# Altium project PDB_REV 22.PrjPcb
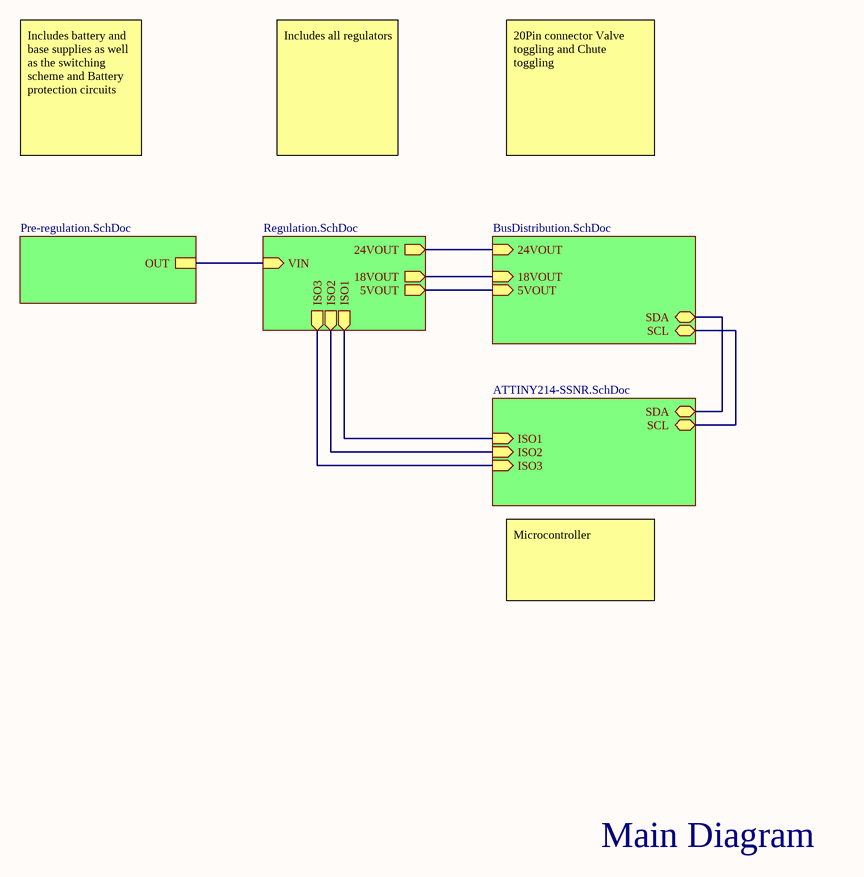
[diagram p0: Main.SchDoc]
10 sheets, 151 parts. Net scope: hierarchical (ports join the sheet entries above them; power ports are global).
Board file: PDB REV 22.PcbDoc
Sheets:
  Main.SchDoc
    U_Intrumentation = ATTINY214-SSNR.SchDoc
    U_Supply&Switching = Pre-regulation.SchDoc
      U_BattVoltageLevelDetector = BattVoltageLevelDetector.SchDoc
      U_Switching_Scheme = Switching_Scheme.SchDoc
    U_Regulation = Regulation.SchDoc
      U_CurrentSensor = CurrentSensor.SchDoc
      U_CurrentSensor = CurrentSensor.SchDoc
      U_CurrentSensor = CurrentSensor.SchDoc
      U_SwitchingRegulator = SwitchingRegulator.SchDoc
    U_BusDistribution = BusDistribution.SchDoc
      VTogg1 = ValveToggling.SchDoc
      VTogg2 = ValveToggling.SchDoc
      VTogg3 = ValveToggling.SchDoc
      VTogg4 = ValveToggling.SchDoc
      VTogg5 = ValveToggling.SchDoc
      VTogg6 = ValveToggling.SchDoc
      VTogg7 = ValveToggling.SchDoc
      VTogg8 = ValveToggling.SchDoc

## Sheet Main.SchDoc
size A

### Sub-sheets
U_BusDistribution = BusDistribution.SchDoc: 24VOUT (in), 5VOUT (in), 18VOUT (in), SDA (bidir), SCL (bidir)
U_Intrumentation = ATTINY214-SSNR.SchDoc: SDA (bidir), SCL (bidir), ISO1 (in), ISO2 (in), ISO3 (in)
U_Regulation = Regulation.SchDoc: ISO1 (out), ISO2 (out), ISO3 (out), 24VOUT (out), VIN (in), 18VOUT (out), 5VOUT (out)
U_Supply&Switching = Pre-regulation.SchDoc: OUT

### Nets
5VOUT: sheet U_Regulation/5VOUT, sheet U_BusDistribution/5VOUT
18VOUT: sheet U_Regulation/18VOUT, sheet U_BusDistribution/18VOUT
24VOUT: sheet U_Regulation/24VOUT, sheet U_BusDistribution/24VOUT
FET_A: sheet U_Supply&Switching/OUT, sheet U_Regulation/VIN
NetIC1_1_1: sheet U_Intrumentation/ISO3, sheet U_Regulation/ISO3
NetIC1_2_1: sheet U_Intrumentation/ISO2, sheet U_Regulation/ISO2
NetIC1_3_1: sheet U_Intrumentation/ISO1, sheet U_Regulation/ISO1
NetP1_19: sheet U_Intrumentation/SCL, sheet U_BusDistribution/SCL
NetP1_20: sheet U_Intrumentation/SDA, sheet U_BusDistribution/SDA

### Notes on the sheet
- Includes battery and base supplies as well as the switching scheme and Battery protection circuits
- Includes all regulators
- 20Pin connector Valve toggling and Chute toggling
- Microcontroller
- Main Diagram

## Sheet ATTINY214-SSNR.SchDoc
size A
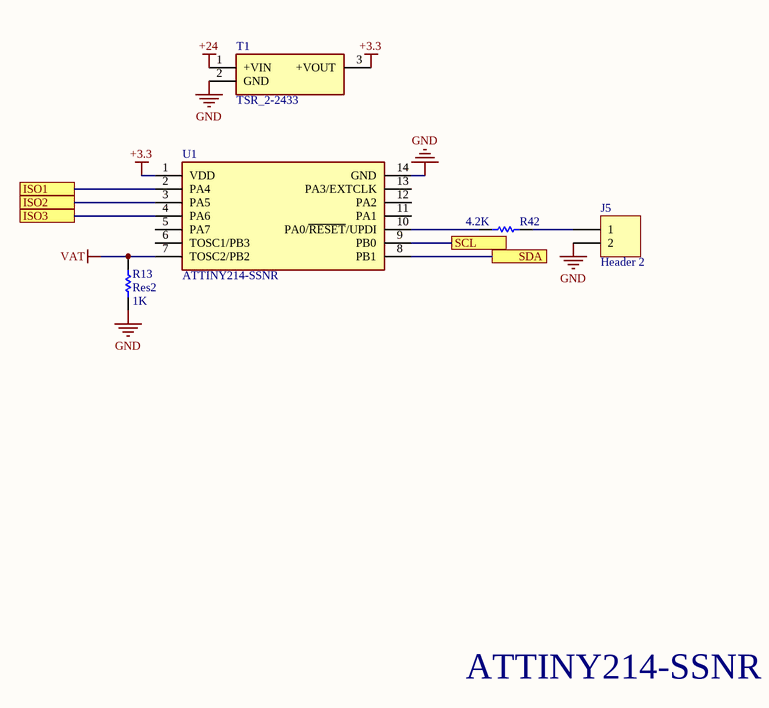
[diagram p1: ATTINY214-SSNR.SchDoc]

### Parts
J5  Header 2  [HDR1X2]
R13  Res2  value 1K  [0402]
R42  value 4.2K  [0402]  (hidden comment: Res10)
T1  TSR_2-2433  [TSR_2-2433]
U1  ATTINY214-SSNR  [SOIC127P600X175-14N]

### Ports
ISO1, ISO2, ISO3, SCL, SDA

### Nets
+3.3: T1.3(+VOUT) U1.1(VDD)
+24: T1.1(+VIN)  [project net IN+]
GND: J5.2 R13.1 T1.2(GND) U1.14(GND)
VAT: R13.2 U1.7(TOSC2/PB2)
NetIC1_1_1: U1.4(PA6) ; port ISO3
NetIC1_2_1: U1.3(PA5) ; port ISO2
NetIC1_3_1: U1.2(PA4) ; port ISO1
NetJ5_1: J5.1 R42.2
NetP1_19: U1.9(PB0) ; port SCL
NetP1_20: U1.8(PB1) ; port SDA
NetR42_1: R42.1 U1.10(PA0/~{RESET}/UPDI)

Not connected (* = marked no-connect by the designer): U1 5(PA7) 6(TOSC1/PB3) 11(PA1) 12(PA2) 13(PA3/EXTCLK)

### Notes on the sheet
- ATTINY214-SSNR

### Library data of the parts
J5 = Header 2: Header, 2-Pin; LatestRevisionDate: 17-Jul-2002; LatestRevisionNote: Re-released for DXP Platform.; Publisher: Altium Limited
R13 R42 = Res1: Resistor; Published: 8-Jun-2000; LatestRevisionDate: 17-Jul-2002; LatestRevisionNote: Re-released for DXP Platform.; PackageReference: AXIAL-0.3; Publisher: Altium Limited; PackageDescription: Axial Device, Thru-Hole; 2 Leads; 0.3 in Pin Spacing
T1 = TSR_2-2433: Transformer; Manufacturer_Name: Traco Power; Manufacturer_Part_Number: TSR 2-2433; Allied_Number: 71066182; Datasheet Link: http://assets.tracopower.com/20170228093640/TSR2/documents/tsr2-datasheet.pdf; Mouser Part Number: 495-TSR2-2433; Mouser Price/Stock: https://www.mouser.com/Search/Refine.aspx?Keyword=495-TSR2-2433; RS Part Number: 9068478P; RS Price/Stock: http://uk.rs-online.com/web/p/products/9068478P; Allied Price/Stock: https://www.alliedelec.com/tracopower-tsr-2-2433/71066182/
U1 = ATTINY214-SSNR: Undefined or Miscellaneous; Manufacturer_Name: Microchip; Datasheet Link: http://ww1.microchip.com/downloads/en/DeviceDoc/40001912A.pdf; Height: 1.75mm; Manufacturer_Part_Number: ATTINY214-SSNR; Mouser Part Number: 579-ATTINY214-SSNR; Mouser Price/Stock: https://www.mouser.com/Search/Refine.aspx?Keyword=579-ATTINY214-SSNR

## Sheet Pre-regulation.SchDoc
size A
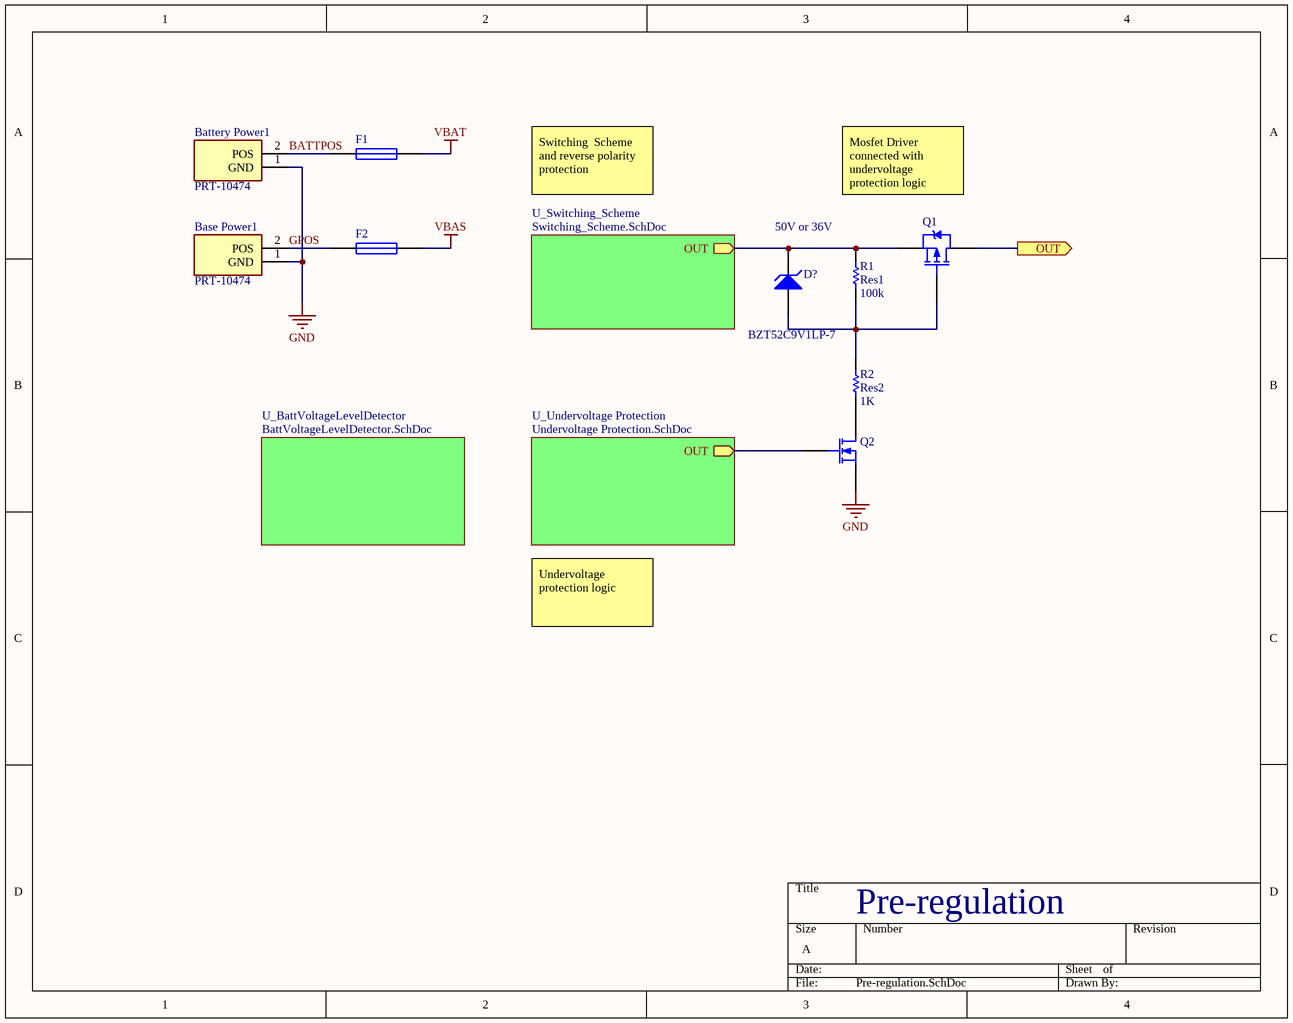
[diagram p2: Pre-regulation.SchDoc]

### Parts
Base_Power1  PRT-10474  [PRT-10474]
Battery_Power1  PRT-10474  [PRT-10474]
D?  BZT52C9V1LP-7  [0402]
F1  Battery Power Fuse  [14-1210]  (value not drawn)
F2  Ground Power Fuse  [14-1210]  (value not drawn)
Q1  Power PMOS  [TO-220AB]  (value not drawn)
Q2  Low power NMOS  [SOT23_L]  (value not drawn)
R1  Res1  value 100k  [0402]
R2  Res2  value 1K  [0402]

### Sub-sheets
U_BattVoltageLevelDetector = BattVoltageLevelDetector.SchDoc: no entries
U_Switching_Scheme = Switching_Scheme.SchDoc: OUT (out)
U_Undervoltage Protection = Undervoltage Protection.SchDoc (file not in this document): OUT (out)

### Ports
OUT (out)

### Nets
GND: Base_Power1.1(GND) Battery_Power1.1(GND) Q2.3(S)
VBAS: F2.2
VBAT: F1.2
BATTPOS: Battery_Power1.2(POS) F1.1
FET_A: Q1.2(D) ; port OUT
GPOS: Base_Power1.2(POS) F2.1
NetC3_1: D?.2(K) Q1.3(S) R1.2 ; sheet U_Switching_Scheme/OUT
NetD?_1: D?.1(A) Q1.1(G) R1.1 R2.2
NetQ2_1: Q2.1(D) R2.1
NetQ2_2: Q2.2(G) ; sheet U_Undervoltage Protection/OUT

### Notes on the sheet
- Switching  Scheme and reverse polarity protection
- 50V or 36V
- Mosfet Driver connected with undervoltage protection logic
- Undervoltage protection logic
- Pre-regulation

### Library data of the parts
Base_Power1 Battery_Power1 = PRT-10474: Connector; Manufacturer_Name: SparkFun; Datasheet Link: http://cdn.sparkfun.com/datasheets/Prototyping/xt60.pdf; Height: 15.875mm; Manufacturer_Part_Number: PRT-10474; Mouser Part Number: 474-PRT-10474; Mouser Price/Stock: https://www.mouser.com/Search/Refine.aspx?Keyword=474-PRT-10474
D? = D Zener: Zener Diode 9.1V 250mW ±6% Surface Mount X1-DFN1006-2; MFG: Diodes Incorporated; Package: 0402; MFG PN: BZT52C9V1LP-7
F1 F2 = Fuse 1: Fuse; Published: 8-Jun-2000; LatestRevisionDate: 17-Jul-2002; LatestRevisionNote: Re-released for DXP Platform.; PackageReference: PIN-W2/E2.8; Publisher: Altium Limited; PackageDescription: Thru-Hole; 2 Leads
Q1 = PMOS-2: P-Channel Power MOSFET; Note: Pin 4 not drawn and electrically connected to Pin 2.; Published: 8-Jun-2000; LatestRevisionDate: 17-Jul-2002; LatestRevisionNote: Re-released for DXP Platform.; DatasheetVersion: PD-9.390D; PackageVersion: Feb-1997; PackageReference: TO-220AB; Publisher: Altium Limited; PackageDescription: TO, Thru-Hole, Vertical, Heatsink Mounted; 3 In-Line Leads; Pitch 2.54 mm; ComponentLink1Description: Manufacturer Link; ComponentLink1URL: http://www.irf.com/
Q2 = MOSFET-N: N-Channel MOSFET; Published: 8-Jun-2000; LatestRevisionDate: 17-Jul-2002; LatestRevisionNote: Re-released for DXP Platform.; PackageVersion: 1995/1996; PackageReference: E3; Publisher: Altium Limited; PackageDescription: TO, Flat Index; 3 In-Line, Axial Leads; Body Dia. 4.6mm; Lead Dia. 0.5 mm (max)
R1 R2 = Res1: Resistor; Published: 8-Jun-2000; LatestRevisionDate: 17-Jul-2002; LatestRevisionNote: Re-released for DXP Platform.; PackageReference: AXIAL-0.3; Publisher: Altium Limited; PackageDescription: Axial Device, Thru-Hole; 2 Leads; 0.3 in Pin Spacing

## Sheet BattVoltageLevelDetector.SchDoc
size A
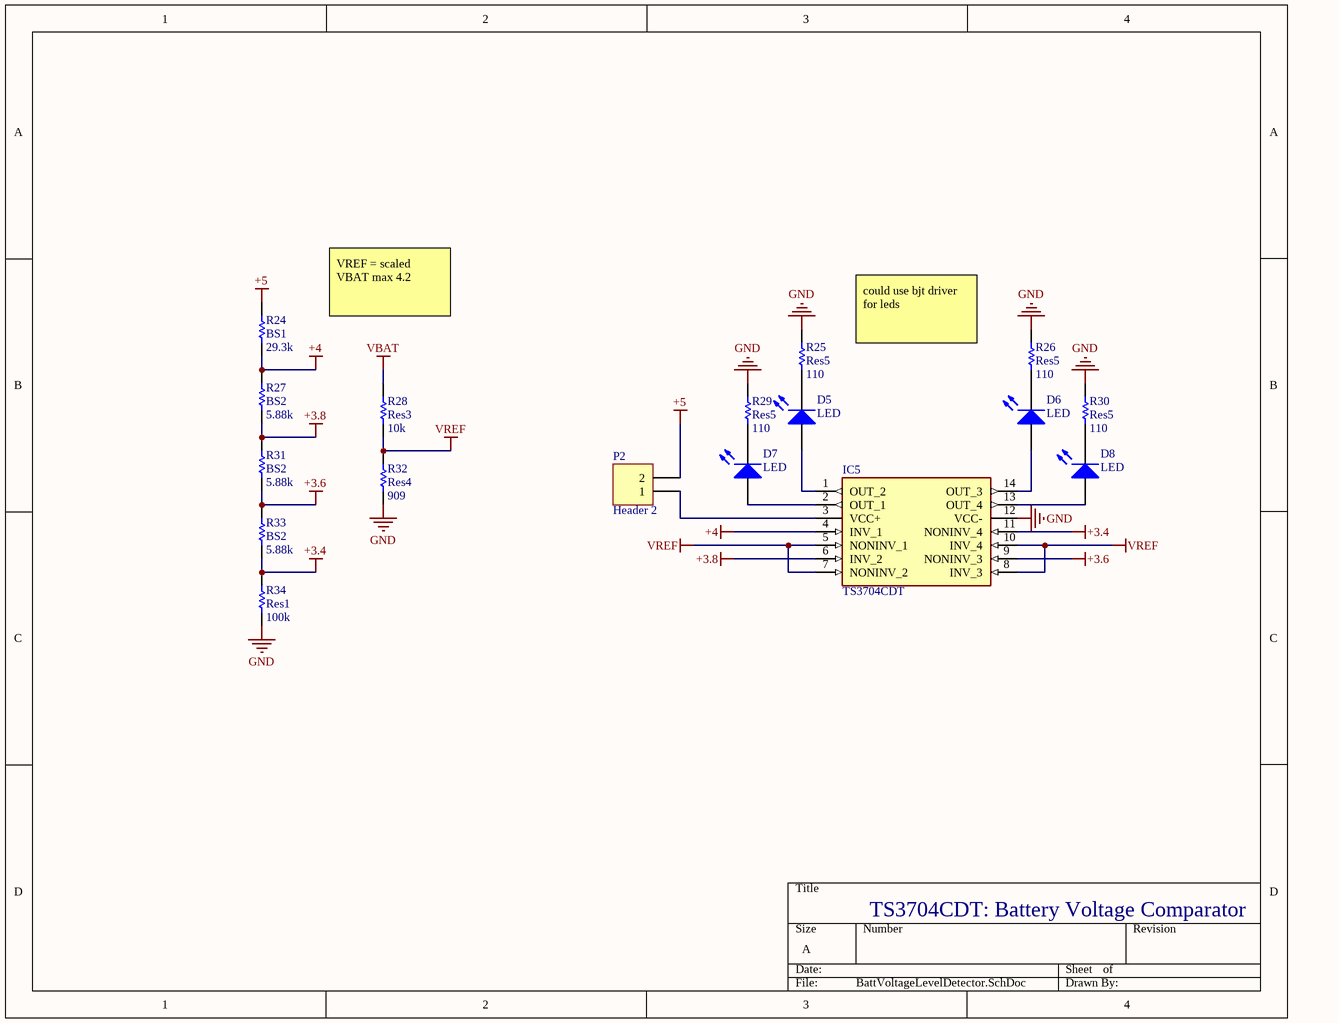
[diagram p3: BattVoltageLevelDetector.SchDoc]

### Parts
D5  LED  [0402]
D6  LED  [0402]
D7  LED  [0402]
D8  LED  [0402]
IC5  TS3704CDT  [SOIC127P600X175-14N]
P2  Header 2  [HDR1X2]
R24  BS1  value 29.3k  [0402]
R25  Res5  value 110  [0402]
R26  Res5  value 110  [0402]
R27  BS2  value 5.88k  [0402]
R28  Res3  value 10k  [0402]
R29  Res5  value 110  [0402]
R30  Res5  value 110  [0402]
R31  BS2  value 5.88k  [0402]
R32  Res4  value 909  [0402]
R33  BS2  value 5.88k  [0402]
R34  Res1  value 100k  [0402]

### Nets
+3.4: IC5.11(NONINV_4) R33.1 R34.2
+3.6: IC5.9(NONINV_3) R31.1 R33.2
+3.8: IC5.6(INV_2) R27.1 R31.2
+4: IC5.4(INV_1) R24.1 R27.2
+5: P2.2 R24.2  [project net 5VOUT]
GND: IC5.12(VCC-) R25.2 R26.2 R29.2 R30.2 R32.1 R34.1
VBAT: R28.2
VREF: IC5.5(NONINV_1) IC5.7(NONINV_2) IC5.8(INV_3) IC5.10(INV_4) R28.1 R32.2
NetD5_1: D5.1(A) IC5.1(OUT_2)
NetD5_2: D5.2(K) R25.1
NetD6_1: D6.1(A) IC5.14(OUT_3)
NetD6_2: D6.2(K) R26.1
NetD7_1: D7.1(A) IC5.2(OUT_1)
NetD7_2: D7.2(K) R29.1
NetD8_1: D8.1(A) IC5.13(OUT_4)
NetD8_2: D8.2(K) R30.1
NetIC5_3: IC5.3(VCC+) P2.1

### Notes on the sheet
- VREF = scaled VBAT max 4.2
- could use bjt driver for leds
- TS3704CDT: Battery Voltage Comparator

### Library data of the parts
D5-D8 = LED0: Typical INFRARED GaAs LED; Published: 8-Jun-2000; LatestRevisionDate: 08-Jul-2005; LatestRevisionNote: Mech Layer 1 removed.; PackageReference: LED-0; Publisher: Altium Limited; PackageDescription: LED; 2 Leads
IC5 = TS3704CDT: Integrated Circuit; Manufacturer_Name: STMicroelectronics; Datasheet Link: http://www.st.com/content/ccc/resource/technical/document/datasheet/ff/2a/23/35/c2/34/44/f1/CD00000883.pdf/files/CD00000883.pdf/jcr:content/translations/en.CD00000883.pdf; Height: 1.75mm; Manufacturer_Part_Number: TS3704CDT; Mouser Part Number: 511-TS3704CDT; Mouser Price/Stock: https://www.mouser.com/Search/Refine.aspx?Keyword=511-TS3704CDT; RS Part Number: 8805496P; RS Price/Stock: http://uk.rs-online.com/web/p/products/8805496P
P2 = Header 2: Header, 2-Pin; LatestRevisionDate: 17-Jul-2002; LatestRevisionNote: Re-released for DXP Platform.; Publisher: Altium Limited
R24-R34 = Res1: Resistor; Published: 8-Jun-2000; LatestRevisionDate: 17-Jul-2002; LatestRevisionNote: Re-released for DXP Platform.; PackageReference: AXIAL-0.3; Publisher: Altium Limited; PackageDescription: Axial Device, Thru-Hole; 2 Leads; 0.3 in Pin Spacing

## Sheet Switching_Scheme.SchDoc
size A
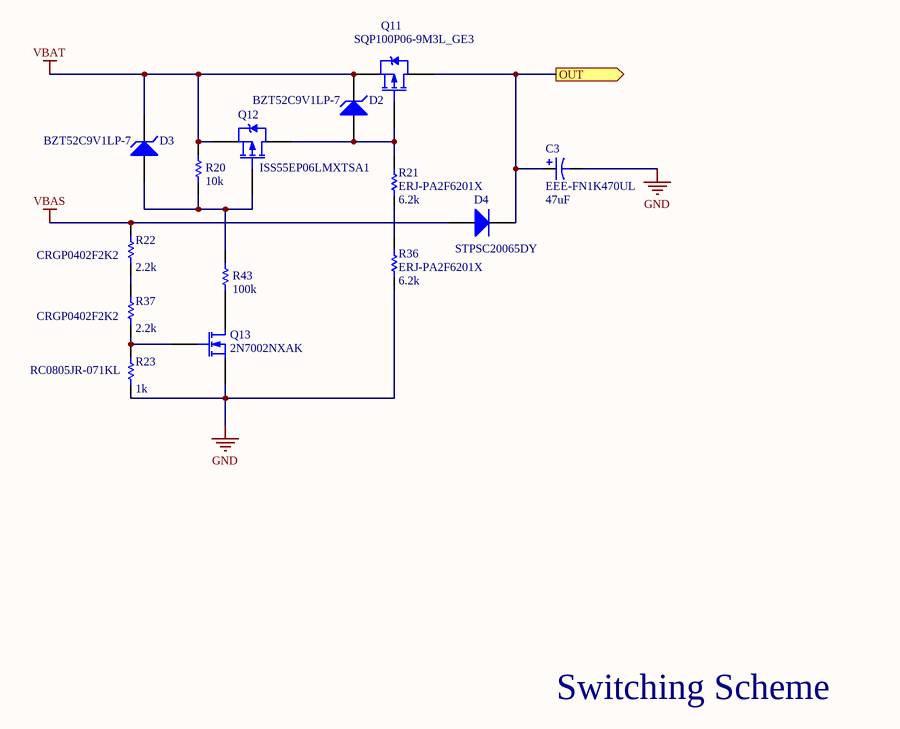
[diagram p4: Switching_Scheme.SchDoc]

### Parts
C3  EEE-FN1K470UL  value 47uF  [CAPAE1030X1450N]
D2  BZT52C9V1LP-7  [0402]
D3  BZT52C9V1LP-7  [0402]
D4  STPSC20065DY  [TO-220AC]
Q11  SQP100P06-9M3L_GE3  [TO-220AB]
Q12  ISS55EP06LMXTSA1  [SOT23_L]
Q13  2N7002NXAK  [SOT23_L]
R20  value 10k  [0402]  (hidden comment: RC0402FR-0710KL)
R21  ERJ-PA2F6201X  value 6.2k  [0402]
R22  CRGP0402F2K2  value 2.2k  [0402]
R23  RC0805JR-071KL  value 1k  [0402]
R36  ERJ-PA2F6201X  value 6.2k  [0402]
R37  CRGP0402F2K2  value 2.2k  [0402]
R43  value 100k  [0402]  (hidden comment: RC0402FR-0710KL)

### Ports
OUT (out)

### Nets
GND: C3.2 Q13.3(S) R23.1 R36.2
VBAS: D4.1(A) R22.2
VBAT: D2.2(K) D3.2(K) Q11.3(S) Q12.3(S) R20.2
NetC3_1: C3.1 D4.2(K) Q11.2(D) ; port OUT
NetD2_1: D2.1(A) Q11.1(G) Q12.2(D) R21.1
NetD3_1: D3.1(A) Q12.1(G) R20.1 R43.2
NetQ13_1: Q13.1(D) R43.1
NetQ13_2: Q13.2(G) R23.2 R37.1
NetR21_2: R21.2 R36.1
NetR22_1: R22.1 R37.2

### Notes on the sheet
- Switching Scheme

### Library data of the parts
C3 = Cap Pol1: 80VDC 47uF 20% 8x10.2mm AEC-Q200; MFG PN: EEH-ZF1J330P; MFG: Panasonic
D2 D3 = D Zener: as D? on sheet Pre-regulation; Package: 0402; MFG PN: BZT52C9V1LP-7
D4 = Diode: Diode Silicon Carbide Schottky 650V 20A Through Hole TO-220AC; pin to pad: 2>3; MFG: STMicroelectronics; MFG PN: STPSC20065DY
Q11 = PMOS-2: P-Channel 60V 100A (Tc) 187W (Tc) Through Hole TO-220AB; Published: 8-Jun-2000; LatestRevisionDate: 17-Jul-2002; LatestRevisionNote: Re-released for DXP Platform.; DatasheetVersion: PD-9.390D; PackageVersion: Feb-1997; PackageReference: TO-220AB; Publisher: Vishay Siliconix; PackageDescription: TO, Thru-Hole, Vertical, Heatsink Mounted; 3 In-Line Leads; Pitch 2.54 mm; ComponentLink1Description: Manufacturer Link; ComponentLink1URL: http://www.irf.com/
Q12 = PMOS-2: P-Channel 60V 180mA (Ta) 400mW (Ta) Surface Mount PG-SOT23-3-5; MFG: Infineon Technologies; PackageReference: TO-220AB; Publisher: ISS55EP06LMXTSA1; ComponentLink1Description: Manufacturer Link; ComponentLink1URL: http://www.irf.com/; MFG PN: ISS55EP06LMXTSA1
Q13 = MOSFET-N: N-Channel 60V 190mA (Ta), 300mA (Tc) 265mW (Ta), 1.33W (Tc) Surface Mount TO-236AB; MFG: Nexperia USA; MDF PN: 2N7002NXAK
R20 R43 = Res1: 10 kOhms ±1% 0.063W, 1/16W Chip Resistor 0402 (1005 Metric) Thick Film; Manufacturer: Yageo; MFG PN: RC0402FR-0710KL
R21 R36 = Res1: ±1% 0.2W, 1/5W Chip Resistor 0402 (1005 Metric) Automotive AEC-Q200, Pulse Withstanding Thick Film; Manufacturer: Panasonic Electronic Components; PackageDescription: ±1% 0.2W, 1/5W Chip Resistor 0402 (1005 Metric) Automotive AEC-Q200, Pulse Withstanding Thick Film; MFG PN: ERJ-PA2F6201X
R22 R37 = Res1: 2.2 kOhms ±1% 0.125W, 1/8W Chip Resistor 0402 (1005 Metric) Pulse Withstanding Thick Film; MFG: TE Connectivity Passive Product; MFG PN: CRGP0402F2K2
R23 = Res1: 1 kOhms ±5% 0.125W, 1/8W Chip Resistor 0805 (2012 Metric)  Thick Film; MFG: Yageo; MFG PN: RC0805JR-071KL

## Sheet Regulation.SchDoc
size A
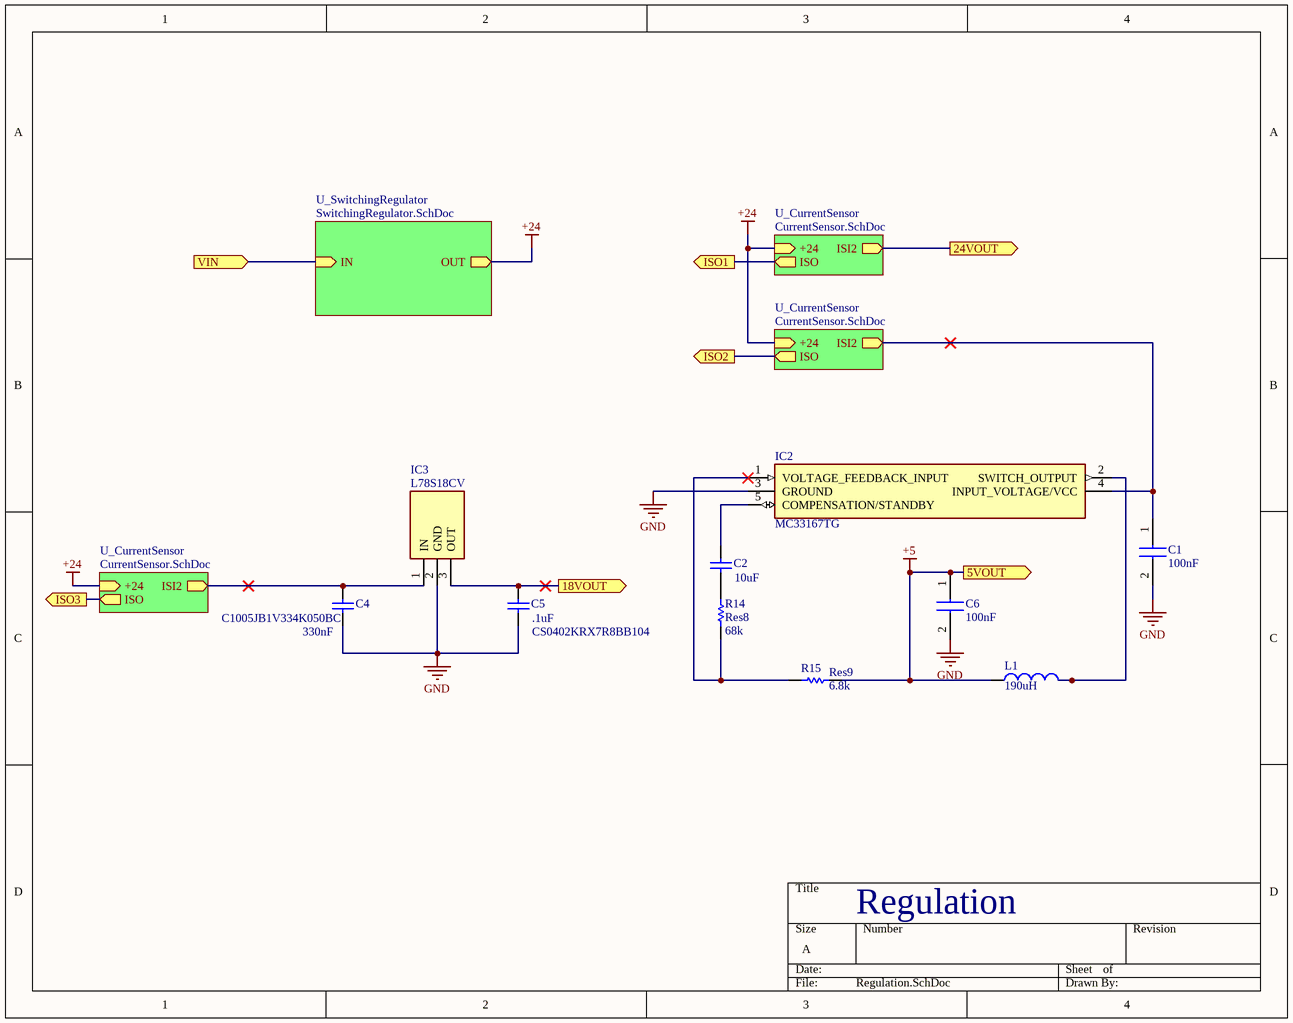
[diagram p5: Regulation.SchDoc]

### Parts
C1  100nF  [865230640001]
C2  value 10uF  [C0805]  (hidden comment: 10uF Cap)
C4  C1005JB1V334K050BC  value 330nF  [0402]
C5  CS0402KRX7R8BB104  value .1uF  [Model Name]
C6  100nF  [865230640001]
IC2  MC33167TG  [MC33167TG]
IC3  L78S18CV  [TO270P460X1020X2008-3P]
L1  value 190uH  [PA2982]  (hidden comment: 190uH Inductor)
R14  Res8  value 68k  [0402]
R15  Res9  value 6.8k  [0402]

### Sub-sheets
U_CurrentSensor = CurrentSensor.SchDoc: ISI2 (out), +24 (in), ISO (out)
U_CurrentSensor = CurrentSensor.SchDoc: ISO (out), +24 (in), ISI2 (out)
U_CurrentSensor = CurrentSensor.SchDoc: +24 (in), ISI2 (out), ISO (out)
U_SwitchingRegulator = SwitchingRegulator.SchDoc: IN (in), OUT (out)

### Ports
5VOUT (out), 18VOUT (out), 24VOUT (out), ISO1 (out), ISO2 (out), ISO3 (out), VIN (in)

### Nets
+5: C6.1(-) L1.1 R15.2 ; port 5VOUT  [project net 5VOUT]
+24: sheet U_CurrentSensor/+24, sheet U_CurrentSensor/+24, sheet U_CurrentSensor/+24, sheet U_SwitchingRegulator/OUT  [project net IN+]
GND: C1.2(+) C4.1 C5.1 C6.2(+) IC2.3(GROUND) IC3.2(GND)
18VOUT: C5.2 IC3.3(OUT) ; port 18VOUT
24VOUT: port 24VOUT, sheet U_CurrentSensor/ISI2
FET_A: port VIN, sheet U_SwitchingRegulator/IN
IN-: C1.1(-) IC2.4(INPUT_VOLTAGE/VCC) ; sheet U_CurrentSensor/ISI2
IN-: C4.2 IC3.1(IN) ; sheet U_CurrentSensor/ISI2  [a separate net that carries the same name]
NetC2_1: C2.1 R14.2
NetC2_2: C2.2 IC2.5(COMPENSATION/STANDBY)
NetIC1_1_1: port ISO3, sheet U_CurrentSensor/ISO
NetIC1_2_1: port ISO2, sheet U_CurrentSensor/ISO
NetIC1_3_1: port ISO1, sheet U_CurrentSensor/ISO
NetIC2_1: IC2.1(VOLTAGE_FEEDBACK_INPUT) R14.1 R15.1
NetIC2_2: IC2.2(SWITCH_OUTPUT) L1.2

### Notes on the sheet
- Regulation

### Library data of the parts
C1 C6 = 865230640001: Capacitor; Manufacturer_Name: Wurth Elektronik; Datasheet Link: http://uk.rs-online.com/webdocs/135a/0900766b8135a640.pdf; Manufacturer_Part_Number: 865230640001; Arrow Part Number: 865230640001; Mouser Part Number: 710-865230640001; Mouser Price/Stock: https://www.mouser.co.uk/ProductDetail/Wurth-Elektronik/865230640001?qs=0KOYDY2FL28kfhWstjZGVg%3D%3D
C2 = Cap: Capacitor; Published: 8-Jun-2000; LatestRevisionDate: 17-Jul-2002; LatestRevisionNote: Re-released for DXP Platform.; PackageReference: RAD-0.3; Publisher: Altium Limited; PackageDescription: Radial Cap, Thru-Hole; 2 Leads; 0.3 in Pin Spacing
C4 = Cap: CAP CER 0.33UF 35V JB 0402; Manufacturer 1: TDK Corporation; Published: 8-Jun-2000; LatestRevisionDate: 17-Jul-2002; LatestRevisionNote: Re-released for DXP Platform.; PackageReference: RAD-0.3; Publisher: Altium Limited; PackageDescription: Radial Cap, Thru-Hole; 2 Leads; 0.3 in Pin Spacing; Manufacturer Part Number 1: C1005JB1V334K050BC
C5 = Cap: CAP CER 0.1UF 25V X7R 0402; Manufacturer 1: Yageo; LatestRevisionNote: Re-released for DXP Platform.; PackageReference: RAD-0.3; Publisher: Altium Limited; PackageDescription: Radial Cap, Thru-Hole; 2 Leads; 0.3 in Pin Spacing; Manufacturer Part Number 1: CS0402KRX7R8BB104
IC2 = MC33167TG: Integrated Circuit; Manufacturer_Name: ON Semiconductor; Allied_Number: 70340012; Datasheet Link: http://www.onsemi.com/pub/Collateral/MC34167-D.PDF; Manufacturer_Part_Number: MC33167TG; Mouser Part Number: 863-MC33167TG; Mouser Price/Stock: https://www.mouser.com/Search/Refine.aspx?Keyword=863-MC33167TG; RS Part Number: 7862414P; RS Price/Stock: http://uk.rs-online.com/web/p/products/7862414P; Allied Price/Stock: http://www.alliedelec.com/on-semiconductor-mc33167tg/70340012/
IC3 = L78S18CV: Integrated Circuit; Manufacturer_Name: STMicroelectronics; Allied_Number: 70013917; Datasheet Link: http://www.st.com/web/en/resource/technical/document/datasheet/CD00000449.pdf; Height: 4.6mm; Manufacturer_Part_Number: L78S18CV; Mouser Part Number: 511-L78S18CV; Mouser Price/Stock: https://www.mouser.com/Search/Refine.aspx?Keyword=511-L78S18CV; RS Part Number: 6869022P; RS Price/Stock: http://uk.rs-online.com/web/p/products/6869022P; Allied Price/Stock: http://www.alliedelec.com/stmicroelectronics-l78s18cv/70013917/
L1 = Inductor: Code_IEC: 1005; Published: 8-Jun-2000; LatestRevisionDate: 29-May-2009; LatestRevisionNote: IPC-7351 Footprint Added.; PackageReference: 0402-A; Publisher: Altium Limited; PackageDescription: Chip Inductor; Code_JEITA: 0402
R14 R15 = Res1: Resistor; Published: 8-Jun-2000; LatestRevisionDate: 17-Jul-2002; LatestRevisionNote: Re-released for DXP Platform.; PackageReference: AXIAL-0.3; Publisher: Altium Limited; PackageDescription: Axial Device, Thru-Hole; 2 Leads; 0.3 in Pin Spacing

## Sheet CurrentSensor.SchDoc
size A
Used 3 times, as channels U_Regulation/U_CurrentSensor, U_Regulation/U_CurrentSensor, U_Regulation/U_CurrentSensor. Parts and nets are listed once, with the designators drawn on the sheet.
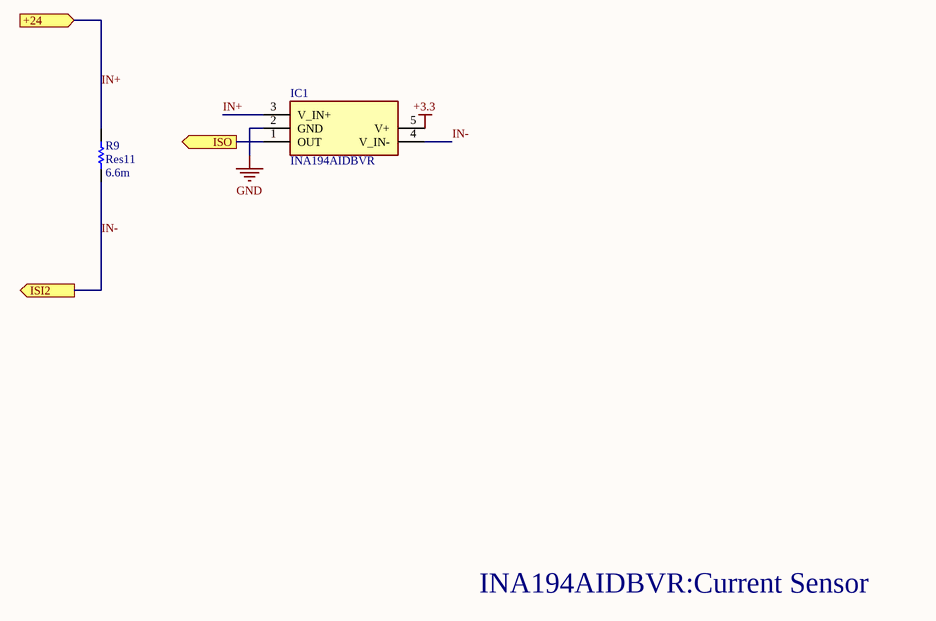
[diagram p6: CurrentSensor.SchDoc]

### Parts
IC1  INA194AIDBVR  [SOT95P280X145-5N]
R9  Res11  value 6.6m  [0402]

### Ports
+24 (in), ISI2 (out), ISO (out)

### Nets
+3.3: IC1.5(V+)
GND: IC1.2(GND)
IN+: IC1.3(V_IN+) R9.2 ; port +24
IN-: IC1.4(V_IN-) R9.1 ; port ISI2
ISO: IC1.1(OUT) ; port ISO

### Channels
U_Regulation/U_CurrentSensor: designators end in _3; ports +24=IN+ ISI2=24VOUT ISO=NetIC1_3_1
U_Regulation/U_CurrentSensor: designators end in _2; ports +24=IN+ ISI2=IN- ISO=NetIC1_2_1
U_Regulation/U_CurrentSensor: designators end in _1; ports +24=IN+ ISI2=IN- ISO=NetIC1_1_1

### Notes on the sheet
- INA194AIDBVR:Current Sensor

### Library data of the parts
IC1 = INA194AIDBVR: Integrated Circuit; Manufacturer_Name: Texas Instruments; Datasheet Link: http://www.ti.com/lit/gpn/ina194; Height: 1.45mm; Manufacturer_Part_Number: INA194AIDBVR; Mouser Part Number: 595-INA194AIDBVR; Mouser Price/Stock: https://www.mouser.com/Search/Refine.aspx?Keyword=595-INA194AIDBVR
R9 = Res1: Resistor; Published: 8-Jun-2000; LatestRevisionDate: 17-Jul-2002; LatestRevisionNote: Re-released for DXP Platform.; PackageReference: AXIAL-0.3; Publisher: Altium Limited; PackageDescription: Axial Device, Thru-Hole; 2 Leads; 0.3 in Pin Spacing

## Sheet SwitchingRegulator.SchDoc
size A
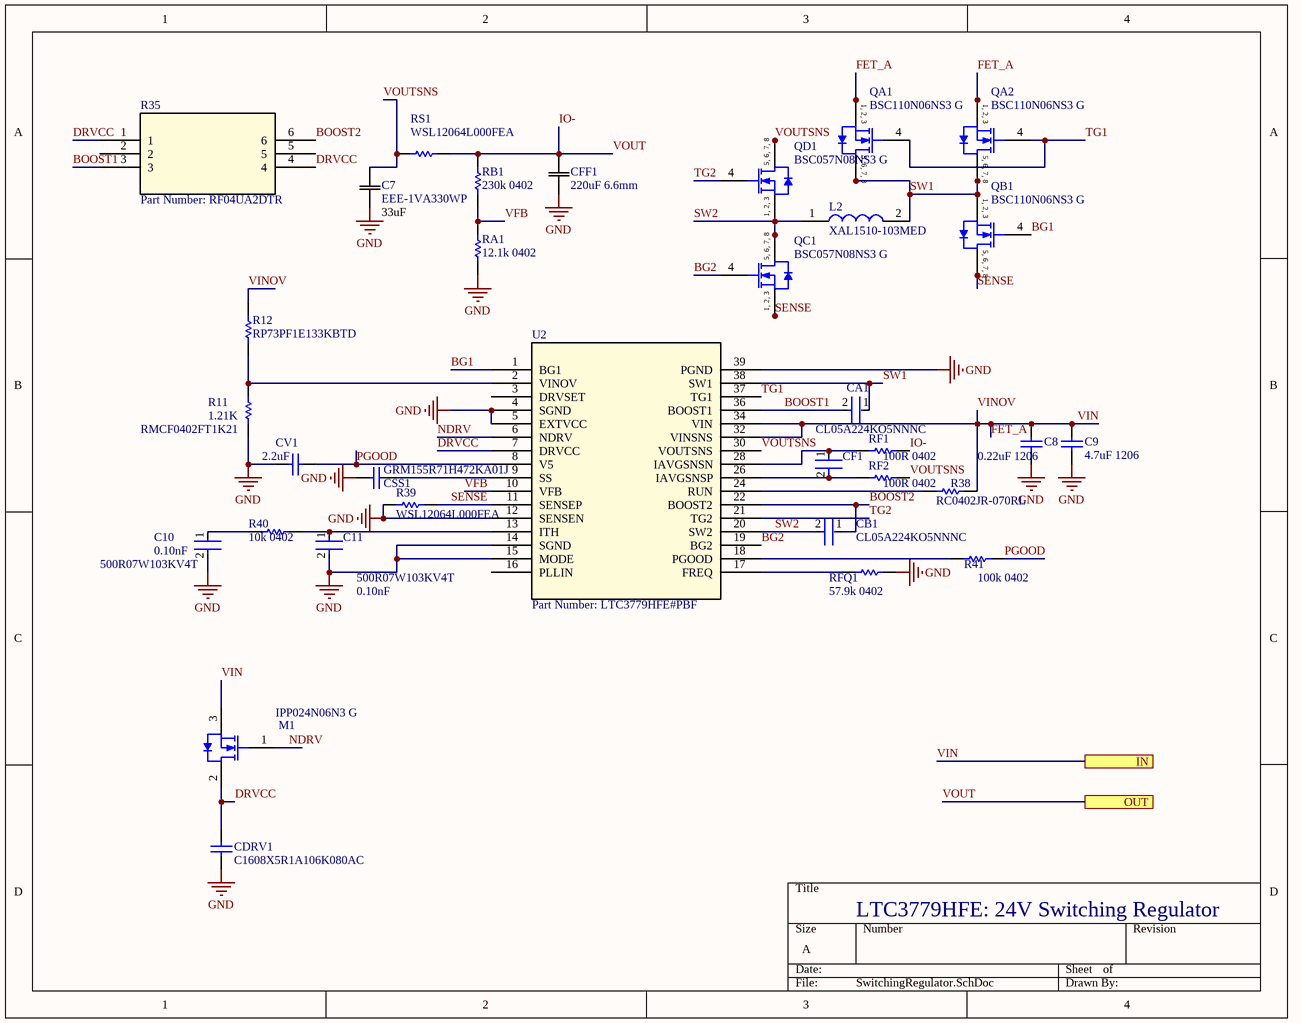
[diagram p7: SwitchingRegulator.SchDoc]

### Parts
C7  EEE-1VA330WP  value 33uF  [CAPAE660X800N]
C8  0.22uF 1206  [CAPC1608X90X35ML10T15]
C9  4.7uF 1206  [CAPC3216X180X50ML20T25]
C10  500R07W103KV4T  Capacitance: 0.10nF  [FP-GRM15-MFG]
C11  500R07W103KV4T  Capacitance: 0.10nF  [FP-GRM15-MFG]
CA1  CL05A224KO5NNNC  [FP-GRM15-MFG]
CB1  CL05A224KO5NNNC  [FP-GRM15-MFG]
CDRV1  C1608X5R1A106K080AC  [CAPC1608X90X20ML10]
CF1  C1608X5R1C335K080AC  [FP-GRM15-MFG]  (value not drawn)
CFF1  220uF 6.6mm  [CAPAE660X800N]
CSS1  GRM155R71H472KA01J  [CAPC1005X55X25NL05T10]
CV1  value 2.2uF  [CAPC1005X55X25ML05T10]  (hidden comment: GRM155R60J225ME15D)
L2  XAL1510-103MED  [XAL1513153MEB]
M1  IPP024N06N3 G  [INF-PG-TO220-3-1_A_V]
QA1  BSC110N06NS3 G  [INF-PG-TDSON-8-1_V]
QA2  BSC110N06NS3 G  [INF-PG-TDSON-8-1_V]
QB1  BSC110N06NS3 G  [INF-PG-TDSON-8-1_V]
QC1  BSC057N08NS3 G  [INF-PG-TDSON-8-1_V]
QD1  BSC057N08NS3 G  [INF-PG-TDSON-8-1_V]
R11  RMCF0402FT1K21  value 1.21K  [RESC1005X40X25NL05T10]
R12  RP73PF1E133KBTD  [RESC1005X40X25NL05T10]
R35  Part Number: RF04UA2DTR  [RF04]
R38  RC0402JR-070RL  [RESC1005X40X25NL05T10]
R39  WSL12064L000FEA  [RESC3216X89X51LL25T25]
R40  10k 0402  [RESC1005X40X25NL05T10]
R41  100k 0402  [RESC1005X40X25NL05T10]
RA1  12.1k 0402  [RESC1005X40X25NL05T10]
RB1  230k 0402  [RESC1005X40X25NL05T10]
RF1  100R 0402  [RESC1005X40X25NL05T05]
RF2  100R 0402  [RESC1005X40X25NL05T05]
RFQ1  57.9k 0402  [RESC1005X40X25NL05T10]
RS1  WSL12064L000FEA  [RESC3216X89X51LL25T25]
U2  Part Number: LTC3779HFE#PBF  [SOP50P640X120-39N]

### Ports
IN, OUT

### Nets
GND: C7.1 C8.1 C9.1 C10.2 C11.2 CDRV1.1 CFF1.1 CSS1.1 CV1.1 R11.2 R39.1 RA1.1 RFQ1.1 U2.4(SGND) U2.5(EXTVCC) U2.12(SENSEN) U2.14(SGND) U2.15(MODE) U2.39(PGND)
IO-: CFF1.2 RB1.2 RF1.2 RS1.2 ; port OUT  [also labelled VOUT]  [project net IN+]
BG1: QB1.4(GATE) U2.1(BG1)
BG2: QC1.4(GATE) U2.19(BG2)
BOOST1: CA1.2 R35.3 U2.36(BOOST1)
BOOST2: CB1.1 R35.6 U2.22(BOOST2)
DRVCC: CDRV1.2 M1.2(DRAIN) R35.1 R35.4 U2.7(DRVCC)
FET_A: C8.2 C9.2 M1.3(SOURCE) QA1.1(SOURCE) QA1.2(SOURCE) QA1.3(SOURCE) QA2.1(SOURCE) QA2.2(SOURCE) QA2.3(SOURCE) R12.1 R38.1 U2.32(VINSNS) U2.34(VIN) ; port IN  [also labelled VIN, VINOV]
NDRV: M1.1(GATE) U2.6(NDRV)
PGOOD: CV1.2 R41.1 U2.8(V5)
SENSE: QB1.5(DRAIN) QB1.6(DRAIN) QB1.7(DRAIN) QB1.8(DRAIN) QC1.1(SOURCE) QC1.2(SOURCE) QC1.3(SOURCE) R39.2 U2.11(SENSEP)
SW1: CA1.1 L2.2 QA1.5(DRAIN) QA1.6(DRAIN) QA1.7(DRAIN) QA1.8(DRAIN) QA2.5(DRAIN) QA2.6(DRAIN) QA2.7(DRAIN) QA2.8(DRAIN) QB1.1(SOURCE) QB1.2(SOURCE) QB1.3(SOURCE) U2.38(SW1)
SW2: CB1.2 L2.1 QC1.5(DRAIN) QC1.6(DRAIN) QC1.7(DRAIN) QC1.8(DRAIN) QD1.1(SOURCE) QD1.2(SOURCE) QD1.3(SOURCE) U2.20(SW2)
TG1: QA1.4(GATE) QA2.4(GATE) U2.37(TG1)
TG2: QD1.4(GATE) U2.21(TG2)
VFB: RA1.2 RB1.1 U2.10(VFB)
VOUTSNS: C7.2 QD1.5(DRAIN) QD1.6(DRAIN) QD1.7(DRAIN) QD1.8(DRAIN) RF2.2 RS1.1 U2.30(VOUTSNS)
NetC10_1: C10.1 R40.2
NetC11_1: C11.1 R40.1 U2.13(ITH)
NetCF1_1: CF1.1 RF1.1 U2.28(IAVGSNSN)
NetCF1_2: CF1.2 RF2.1 U2.26(IAVGSNSP)
NetCSS1_2: CSS1.2 U2.9(SS)
NetR11_1: R11.1 R12.2 U2.2(VINOV)
NetR38_2: R38.2 U2.24(RUN)
NetR41_2: R41.2 U2.18(PGOOD)
NetRFQ1_2: RFQ1.2 U2.17(FREQ)

Not connected (* = marked no-connect by the designer): R35 2 5; U2 3(DRVSET) 16(PLLIN)

### Notes on the sheet
- LTC3779HFE: 24V Switching Regulator
- (in symbol CMP-1091-00029-1) 5, 6, 7, 8; 1, 2, 3
- (in symbol CMP-1091-00074-1) 1, 2, 3; 5, 6, 7, 8

### Library data of the parts
C7 = UCV1V221MCL1GS: CAP ALUM 33UF 20% 35V SMD; Manufacturer 1: Panasonic Electronic Components; Manufacturer Part Number 1: EEE-1VA330WP
C8 = CMP-2100-03642-1: Chip Capacitor, 10 nF, +/- 10%, 50 V, -55 to 125 degC, 0603 (1608 Metric), RoHS, Tape and Reel; Manufacturer: Murata; Insulation Resistance: 10GR; Dielectric: X7R; Voltage Rating: 50V; Capacitance: 10nF; Material: Ceramic; Package Quantity: 1; Lead Free: LeadFree; Case/Package: 0603; Termination: SMD/SMT; REACH SVHC: Unknown; Manufacturer URL: http://www.murata.com/; Datasheet URL: http://search.murata.co.jp/Ceramy/image/img/A01X/G101/ENG/GRM188R71H103KA01-01.pdf; Mount: SurfaceMount; Datasheet Version: 42401.0; Number of Pins: 2; Length: 1.6mm; Voltage: 50V; Depth: 0.8mm; Tolerance: 10%; Min Operating Temperature: -55degC; Voltage Rating (DC): 50V; Max Operating Temperature: 125degC; Package Description: 2-Pin Surface Mount Device, Body 1.6 x 0.8 mm; RoHSCompliant: True; Case Code (Imperial): 0603; Width: 0.031inch; Case Code (Metric): 1608; Height: 0.8mm; Package Reference: 0603; Packaging: TapeandReel; Thickness: 0.035inch; Dielectric Material: Ceramic
C9 = CMP-2000-04991-1: Chip Capacitor, 1 uF, +/- 10%, 25 V, -55 to 125 degC, 1206 (3216 Metric), RoHS, Tape and Reel; Manufacturer: Kemet; Temperature Coefficient / Code: +/-15%; Capacitance: 1uF; Dielectric: X7R; Voltage Rating DC: 25V; Capacitance - nF: 1000nF; Class: Class1; Case Length: 3.2mm; Type: SMDMLCCX7R6.3-250VDCCommericalGrade; Case Width: 1.6mm; Product: GeneralTypeMLCCs; Datasheet URL: https://ciiva.com/datasheet-click-18194173?src=ciiva&sig=6daff8c4; Operating Temperature Range: -55Cto+125C; Series: C1206C; RoHS: Details; Product Category: MultilayerCeramicCapacitorsMLCC-SMD/SMT; Manufacturer URL: http://www.kemet.com/; Minimum Operating Temperature: -55C; Dimensions: 1.6mmWx3.2mmLx1.6mmH; Termination Style: SMD/SMT; Brand: Kemet; Packaging: Reel; Package / Case: 1206(3216metric); Case Code - mm: 3216; Datasheet Version: Jul-14; Factory Pack Quantity: 2000; Package Description: 2-Pin Surface Mount Device, Body 3.2 x 1.6 mm; Tolerance: 10%; Package Reference: 1206; Case Height: 1.6mm; Case Code - in: 1206; Maximum Operating Temperature: +125C; Voltage Rating: 25V
C10 C11 = CMP-06035-000102-1: CAP CER 0.1UF 16V X7R 0402; Manufacturer Part Number: GRM155R71C104KA88D; Manufacturer: Murata; Manufacturer 1: Johanson Dielectrics Inc.; Standoff Height: 0mm; Tolerance: 10%; Voltage Rating: 16Vdc; Material: Ceramic; Value: 0.10μF; RoHS: TRUE; Temperature Characteristic: X7R; Octopart: https://octopart.com/grm155r71c104ka88d-murata-196880; Digikey Description: CAP CER 0.1UF 16V X7R 0402; Device Class L3: Ceramic Capacitors; Height: 0.55mm; ComponentLink2Description: Datasheet; Temperature Range Low: -55°C; Ipc Land Pattern Name: CAPC10050X219; ComponentLink2URL: https://search.murata.co.jp/Ceramy/image/img/A01X/G101/ENG/GRM155R71H471KA01-01A.pdf; Device Class L1: Passive Components; Lead Free: yes; Category: Cap; Package: GRM15; Temperature: -55°C to +125°C; Device Class L2: Capacitors; Temperature Range High: +125°C; Mouser Description: 0402 0.1 uF 16V ±10 % Tolerance X7R SMT Multilayer Ceramic Capacitor; Manufacturer Part Number 1: 500R07W103KV4T
CA1 CB1 = CMP-06035-000102-1: CAP CER 0.22UF 16V X5R 0402; Manufacturer 1: Samsung Electro-Mechanics; Value: 0.22μF; Manufacturer Part Number 1: CL05A224KO5NNNC
CDRV1 = CMP-2000-04979-1: Chip Capacitor, 10 uF, +/- 10%, 10 V, -55 to 85 degC, 0603 (1608 Metric), RoHS, Tape and Reel; PCN Part Number: MLCCPartNumberChange30/Nov/2012; Manufacturer: TDK; Temperature Coefficient: X5R; Product Training Modules: CSeriesGeneralApplicationsSEAT,CCV,andTVCLDesignToolsGuidetoReplacinganElectrolyticCapacitorwithanMLCC; Online Catalog: CSeries,GeneralPurpose; Voltage - Rated: 10V; Other Names: 445-7486-1; Capacitance: 10µF; Design Resources: 20WNon-IsolatedBuckLEDDriverUsingPLLNK460KG; Kits: 445-9003-KIT-ND-KITCAPCERHICAPMLCCSMD; Height - Seated (Max): -; Family: CeramicCapacitors; Package Description: 2-Pin Surface Mount Device, Body 1.6 x 0.8 mm; Category: Capacitors; Datasheet Version: Mar-15; RoHS Information: RoHSCertificate-MLCC; Thickness (Max): 0.035"(0.90mm); Operating Temperature: -55degC~85degC; Package Reference: 603; Series: C; Applications: GeneralPurpose; Datasheet URL: http://download.siliconexpert.com/pdfs/2015/4/21/15/54/45/779/tdk_/manual/37024850441143360mlcc_commercial_general_en.pdf; Features: -; Lead Style: -; Lead Spacing: -; Ratings: -; Size / Dimension: 0.063"Lx0.031"W(1.60mmx0.80mm); Tolerance: ±10%; Mounting Type: SurfaceMount,MLCC; Standard Package: 1; Package / Case: 0603(1608Metric); Manufacturer URL: http://www.tdk.com/; Packaging: CutTape(CT)
CF1 = CMP-06035-000102-1: CAP CER 3.3UF 16V X5R 0603; Manufacturer 1: TDK Corporation; Value: 3.3uF; Manufacturer Part Number 1: C1608X5R1C335K080AC
CFF1 = UCV1V221MCL1GS: No Description Available; Vendor: Nichicon; Built_By: EMA_Cory; SourceLibrary: Nichicon_2019-09-13; Manufacturer_Part_Number: UCV1V221MCL1GS; Copyright: Copyright (C) 2018 Accelerated Designs. All rights reserved; RefDes: RefDes; Type: DEV; Value: Value
CSS1 = CMP-2008-04033-1: CAP CER 4700PF 50V X7R 0402; Manufacturer 1: Murata; Manufacturer Part Number 1: GRM155R71H472KA01J
CV1 = CMP-2008-04543-1: CAP CER 2.2UF 6.3V X5R 0402; Manufacturer 1: Murata Electronics; Manufacturer Part Number 1: GRM155R60J225ME15D
L2 = XAL1510-103MED: Inductor; Manufacturer_Name: COILCRAFT; Datasheet Link: https://www.coilcraft.com/pdfs/xal1510.pdf; Height: 13mm; Manufacturer_Part_Number: XAL1510-103MED; Arrow Part Number: XAL1510-103MED; Mouser Part Number: 994-XAL1510-103MED; Mouser Price/Stock: https://www.mouser.co.uk/ProductDetail/Coilcraft/XAL1510-103MED?qs=41NYZ3YTmyo92lKEhFAS8w%3D%3D
M1 = CMP-1091-00132-1: N-Channel OptiMOS 3 Power-Transistor, 60 V VDS, 120 A ID, -55 to 175 degC, PG-TO220-3-1, Tube, Green; Manufacturer: Infineon; RDS (on) (max): 2.4Â mOhm; VGS(th) (max): 4Â V; VGS(th) (min): 2Â V; Polarity: N; Rth: 0.6Â K/W; IDpuls (max): 480Â A; Ptot (max): 250Â W; VDS (max): 60Â V; QG: 206Â nC; Green: TRUE; RthJA (max): 62Â K/W; ID (max): 120Â A; PackageDescription: 3-Pin Plastic (Green) Transistor Single Outline Package, 10.03 x 8.98 mm Body, 2.54 mm Pitch; ComponentLink2Description: Datasheet; ComponentLink2URL: http://www.infineon.com/dgdl/IPP024N06N3_Rev2.2.pdf?folderId=db3a304313b8b5a60113cee8763b02d7&fileId=db3a30432313ff5e01239f1f52a67151; PartNumber: IPP024N06N3 G; ComponentLink3Description: Package Specification; ComponentLink1Description: Manufacturer URL; Packing: Tube; ComponentLink3URL: http://www.infineon.com/dgdl/IPP028N08N3_Rev1%5B1%5D.0.pdf?folderId=db3a304313b8b5a60113cee8763b02d7&fileId=db3a30432313ff5e0123a3c08e7326b5; RthJC (max): 0.6Â K/W; PackageVersion: Rev. 05, 08/2007; ComponentLink1URL: http://www.infineon.com/; Halogen-free: TRUE; Mounting Technology: Through Hole; DatasheetVersion: Rev. 2.2; PackageReference: PG-TO220-3-1
QA1 QA2 QB1 = CMP-1091-00074-1: N-Channel OptiMOS 3 Power-Transistor, 60 V VDS, 50 A ID, -55 to 150 degC, PG-TDSON-8-1, Reel, Green; Manufacturer: Infineon; RDS (on) (max): 11Â mOhm; ID (max): 50Â A; VGS(th) (max): 4Â V; RthJA (max): 62 K/W; Ptot (max): 50Â W; VGS(th) (min): 2Â V; VDS (max): 60Â V; QG: 25Â nC; IDpuls (max): 200Â A; Polarity: N; Rth: 2.5Â K/W; Green: TRUE; Packing: Reel; DatasheetVersion: Rev. 2.3; ComponentLink2URL: http://www.infineon.com/dgdl/BSC110N06NS3_Rev2.3.pdf?folderId=db3a30431ddc9372011ebafa04517f8b&fileId=db3a30431ddc9372011ebb0be43c7fe6; ComponentLink1Description: Manufacturer URL; PackageDescription: 8-Pin Plastic (Green) Thin Dual Small Outline Non-Leaded Package, 5.15 x 5.9 mm Body, 1.27 mm Pitch; ComponentLink3Description: Package Specification; PackageReference: PG-TDSON-8-1; ComponentLink1URL: http://www.infineon.com/; ComponentLink3URL: http://www.infineon.com/cms/packages/SMD_-_Surface_Mounted_Devices/P-PG-TDSON/P-PG-TDSON-08-01x_2x_3.html?__locale=en; ComponentLink2Description: Datasheet; Halogen-free: TRUE; PartNumber: BSC110N06NS3 G; Mounting Technology: Surface Mount; RthJC (max): 2.5Â K/W
QC1 QD1 = CMP-1091-00029-1: N-Channel OptiMOS 3 Power-Transistor, 80 V VDS, 100 A ID, -55 to 150 degC, PG-TDSON-8-1, Reel, Green; Manufacturer: Infineon; Green: TRUE; Ptot (max): 114Â W; RDS (on) (max): 5.7Â mOhm; RthJC (max): 1.1Â K/W; QG: 42Â nC; Polarity: N; RthJA (max): 62Â K/W; IDpuls (max): 400Â A; VGS(th) (min): 2Â V; VGS(th) (max): 3.5Â V; VDS (max): 80Â V; ID (max): 100Â A; ComponentLink1Description: Manufacturer URL; DatasheetVersion: Rev. 2.4; ComponentLink3Description: Package Specification; PartNumber: BSC057N08NS3 G; PackageReference: PG-TDSON-8-1; PackageDescription: 8-Pin Plastic (Green) Thin Dual Small Outline Non-Leaded Package, 5.15 x 5.9 mm Body, 1.27 mm Pitch; Mounting Technology: Surface Mount; Packing: Reel; Halogen-free: TRUE; ComponentLink3URL: http://www.infineon.com/cms/packages/SMD_-_Surface_Mounted_Devices/P-PG-TDSON/P-PG-TDSON-08-01x_2x_3.html?__locale=en; ComponentLink2URL: http://www.infineon.com/dgdl/BSC057N08NS3G_rev2.4.pdf?folderId=db3a304313b8b5a60113cee8763b02d7&fileId=db3a30431add1d95011ae803c9345616; ComponentLink2Description: Datasheet; ComponentLink1URL: http://www.infineon.com/; Rth: 1.1Â K/W
R11 = CMP-2002-07912-1: RES 1.21K OHM 1% 1/16W 0402; Manufacturer: Yageo / Phycomp; Part Number: RC0402JR-070RL
R12 = CMP-2002-07912-1: RES 133K OHM 0.1% 1/10W 0402; Manufacturer 1: TE Connectivity Passive Product; Manufacturer Part Number 1: RP73PF1E133KBTD
R35 = RF04UA2DTR: No Description Available; Vendor: ROHM Semiconductor; Built_By: EMA_Matt; SourceLibrary: Rohm_2019-09-23; Manufacturer_Part_Number: RF04UA2DTR; Copyright: Copyright (C) 2018 Accelerated Designs. All rights reserved; RefDes: RefDes; Type: DEV; Value: Value
R38 = CMP-2002-07912-1: Manufacturer: Yageo / Phycomp; Part Number: RC0402JR-070RL
R39 RS1 = CMP-2003-04339-1: RES SMD 4mR 1% 1/8W 1206 /; Manufacturer 1: Vishay Dale; Manufacturer Part Number 1: WSL12064L000FEA; Description: RES SMD 4mR 1% 1/8W 1206
R40 R41 RA1 RB1 RFQ1 = CMP-2002-07912-1: Manufacturer: Yageo / Phycomp; Part Number: RC0402JR-070RL
RF1 RF2 = CMP-2002-08127-1: Part Number: CRCW0402100RFKED; Manufacturer: Vishay Dale
U2 = LTC3779HFE#PBF: No Description Available; Built_By: EMA_Jessica; Vendor: Analog Devices Inc; SourceLibrary: Analog_Devices_2018-09-28; Copyright: Copyright (C) 2016 Accelerated Designs. All rights reserved; Manufacturer_Part_Number: LTC3779HFE#PBF; RefDes: RefDes; Type: DEV; Value: Value

## Sheet BusDistribution.SchDoc
size A
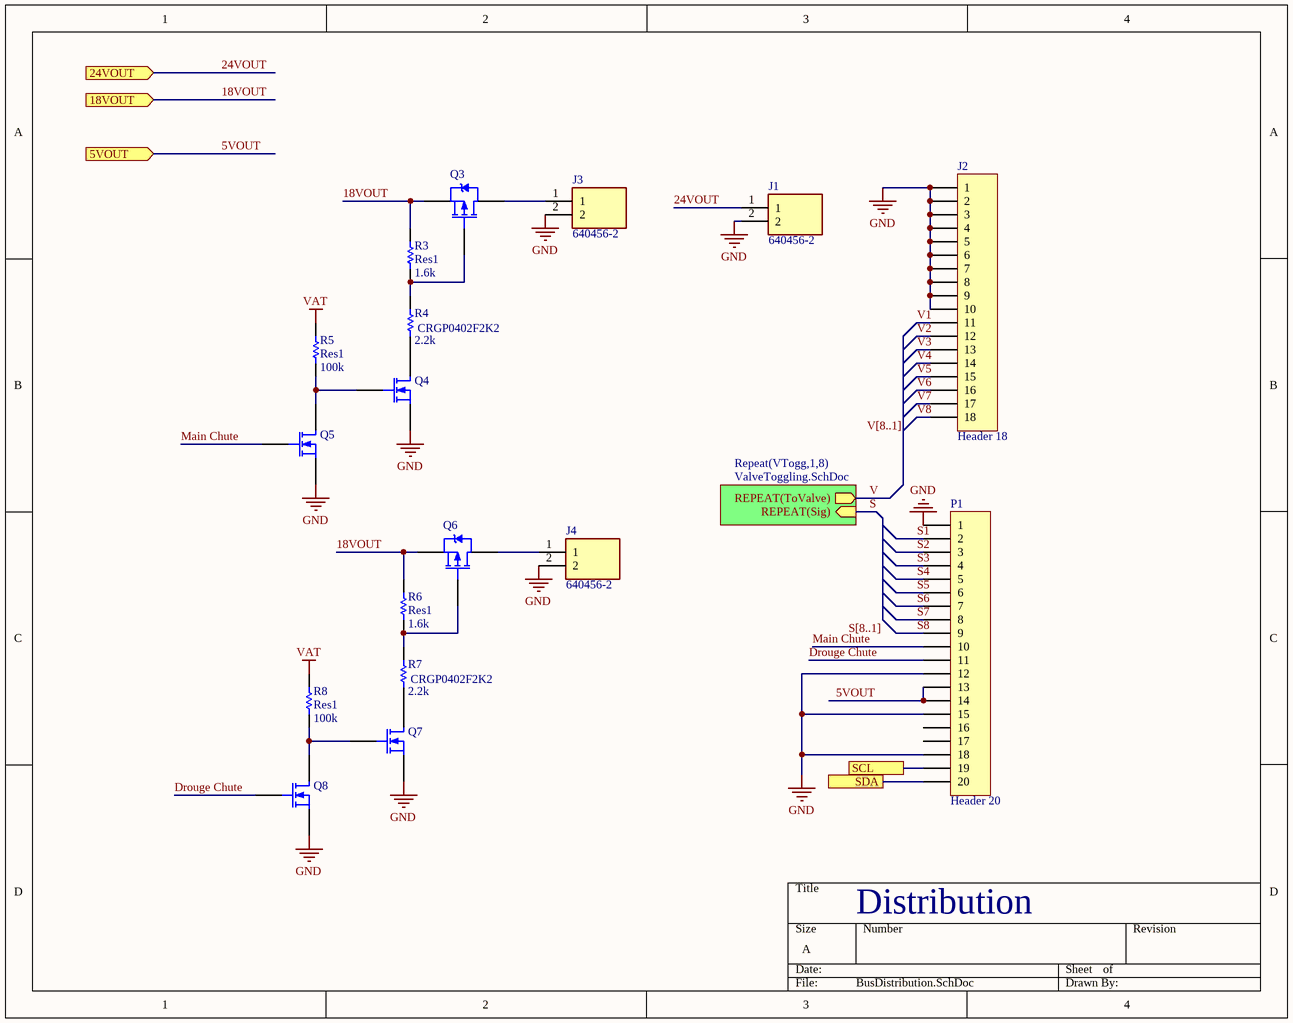
[diagram p8: BusDistribution.SchDoc]

### Parts
J1  640456-2  [16404562]
J2  Header 18  [15247182]
J3  640456-2  [16404562]
J4  640456-2  [16404562]
P1  Header 20  [HDR1X20]
Q3  MED power PMOS  [SOT23_L]  (value not drawn)
Q4  Low Power NMOS  [SOT23_L]  (value not drawn)
Q5  Low power NMOS  [SOT23_L]  (value not drawn)
Q6  MED power PMOS  [SOT23_L]  (value not drawn)
Q7  Low Power NMOS  [SOT23_L]  (value not drawn)
Q8  Low Power NMOS  [SOT23_L]  (value not drawn)
R3  Res1  value 1.6k  [0402]
R4  CRGP0402F2K2  value 2.2k  [0402]
R5  Res1  value 100k  [0402]
R6  Res1  value 1.6k  [0402]
R7  CRGP0402F2K2  value 2.2k  [0402]
R8  Res1  value 100k  [0402]

### Sub-sheets
Repeat(VTogg,1,8) = ValveToggling.SchDoc: REPEAT(Sig) (in), REPEAT(ToValve) (out)

### Ports
5VOUT (in), 18VOUT (in), 24VOUT (in), SCL, SDA

### Nets
5VOUT: P1.13 P1.14 ; port 5VOUT
GND: J1.2 J2.1 J2.2 J2.3 J2.4 J2.5 J2.6 J2.7 J2.8 J2.9 J2.10 J3.2 J4.2 P1.1 P1.12 P1.15 P1.18 Q4.3(S) Q5.3(S) Q7.3(S) Q8.3(S)
VAT: R5.2 R8.2
18VOUT: Q3.3(S) Q6.3(S) R3.2 R6.2 ; port 18VOUT
24VOUT: J1.1 ; port 24VOUT
Drouge Chute: P1.11 Q8.2(G)
Main Chute: P1.10 Q5.2(G)
S: sheet Repeat(VTogg,1,8)/REPEAT(Sig)
S1: P1.2
S2: P1.3
S3: P1.4
S4: P1.5
S5: P1.6
S6: P1.7
S7: P1.8
S8: P1.9
V: sheet Repeat(VTogg,1,8)/REPEAT(ToValve)
V1: J2.11
V2: J2.12
V3: J2.13
V4: J2.14
V5: J2.15
V6: J2.16
V7: J2.17
V8: J2.18
NetJ3_1: J3.1 Q3.2(D)
NetJ4_1: J4.1 Q6.2(D)
NetP1_19: P1.19 ; port SCL
NetP1_20: P1.20 ; port SDA
NetQ3_1: Q3.1(G) R3.1 R4.2
NetQ4_1: Q4.1(D) R4.1
NetQ4_2: Q4.2(G) Q5.1(D) R5.1
NetQ6_1: Q6.1(G) R6.1 R7.2
NetQ7_1: Q7.1(D) R7.1
NetQ7_2: Q7.2(G) Q8.1(D) R8.1

Not connected (* = marked no-connect by the designer): P1 16 17

### Buses and harness runs
bus S[8..1]
bus V[8..1]

### Notes on the sheet
- Distribution

### Library data of the parts
J1 J3 J4 = 640456-2: Connector; Manufacturer_Name: TE Connectivity; Allied_Number: 70083642; Datasheet Link: http://www.te.com/commerce/DocumentDelivery/DDEController?Action=showdoc&DocId=Customer+Drawing%7F640456%7FW3%7Fpdf%7FEnglish%7FENG_CD_640456_W3.pdf%7F640456-2; Height: 7.747mm; Manufacturer_Part_Number: 640456-2; Mouser Part Number: 571-6404562; Mouser Price/Stock: https://www.mouser.com/Search/Refine.aspx?Keyword=571-6404562; RS Part Number: 1320355P; RS Price/Stock: http://uk.rs-online.com/web/p/products/1320355P; Allied Price/Stock: https://www.alliedelec.com/te-connectivity-640456-2/70083642/
J2 = Header 18: Header, 18-Pin; LatestRevisionDate: 17-Jul-2002; LatestRevisionNote: Re-released for DXP Platform.; Publisher: Altium Limited
P1 = Header 20: Header, 20-Pin; LatestRevisionDate: 17-Jul-2002; LatestRevisionNote: Re-released for DXP Platform.; Publisher: Altium Limited
Q3 Q6 = PMOS-2: as Q1 on sheet Pre-regulation; Published: 8-Jun-2000; LatestRevisionDate: 17-Jul-2002; LatestRevisionNote: Re-released for DXP Platform.; DatasheetVersion: PD-9.390D; PackageVersion: Feb-1997; PackageReference: TO-220AB; Publisher: Altium Limited; PackageDescription: TO, Thru-Hole, Vertical, Heatsink Mounted; 3 In-Line Leads; Pitch 2.54 mm; ComponentLink1Description: Manufacturer Link; ComponentLink1URL: http://www.irf.com/
Q4 Q5 Q7 Q8 = MOSFET-N: N-Channel MOSFET; Published: 8-Jun-2000; LatestRevisionDate: 17-Jul-2002; LatestRevisionNote: Re-released for DXP Platform.; PackageVersion: 1995/1996; PackageReference: E3; Publisher: Altium Limited; PackageDescription: TO, Flat Index; 3 In-Line, Axial Leads; Body Dia. 4.6mm; Lead Dia. 0.5 mm (max)
R3 R5 R6 R8 = Res1: Resistor; Published: 8-Jun-2000; LatestRevisionDate: 17-Jul-2002; LatestRevisionNote: Re-released for DXP Platform.; PackageReference: AXIAL-0.3; Publisher: Altium Limited; PackageDescription: Axial Device, Thru-Hole; 2 Leads; 0.3 in Pin Spacing
R4 R7 = Res1: as R22 on sheet Switching_Scheme; MFG PN: CRGP0402F2K2

## Sheet ValveToggling.SchDoc
size A
Used 8 times, as channels U_BusDistribution/VTogg1, U_BusDistribution/VTogg2, U_BusDistribution/VTogg3, U_BusDistribution/VTogg4, U_BusDistribution/VTogg5, U_BusDistribution/VTogg6, U_BusDistribution/VTogg7, U_BusDistribution/VTogg8. Parts and nets are listed once, with the designators drawn on the sheet.
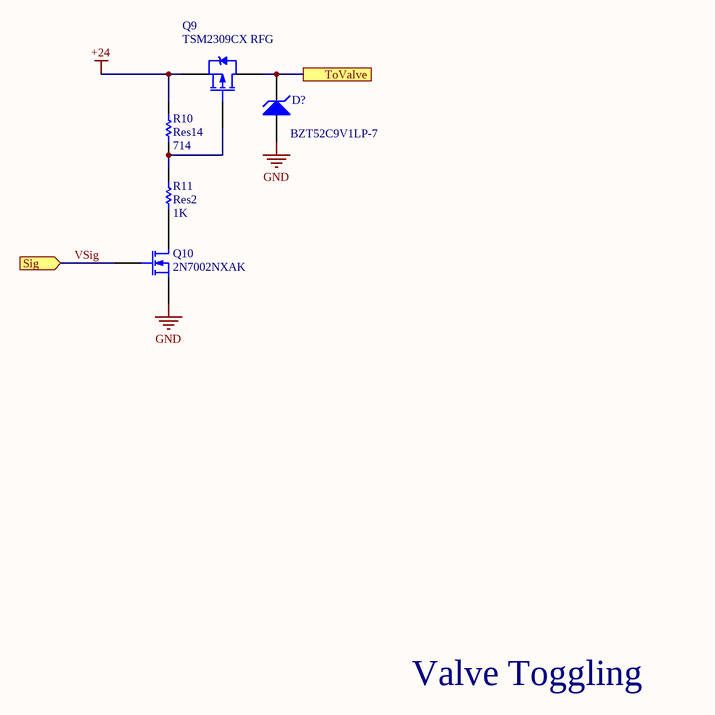
[diagram p9: ValveToggling.SchDoc]

### Parts
D?  BZT52C9V1LP-7  [0402]
Q9  TSM2309CX RFG  [SOT23_L]
Q10  2N7002NXAK  [SOT23_L]
R10  Res14  value 714  [0402]
R11  Res2  value 1K  [0402]

### Ports
Sig (in), ToValve

### Nets
+24: Q9.3(S) R10.2
GND: D?.1(A) Q10.3(S)
ToValve: D?.2(K) Q9.2(D) ; port ToValve
VSig: Q10.2(G) ; port Sig
NetQ9_1: Q9.1(G) R10.1 R11.2
NetQ10_1: Q10.1(D) R11.1

### Channels
U_BusDistribution/VTogg1: designators D?=D?_VTogg1 Q9=Q9_1 Q10=Q10_VTogg1 R10=R10_1 R11=R11_1; ports Sig=S1 ToValve=V1
U_BusDistribution/VTogg2: designators D?=D?_VTogg2 Q9=Q9_2 Q10=Q10_VTogg2 R10=R10_2 R11=R11_2; ports Sig=S2 ToValve=V2
U_BusDistribution/VTogg3: designators D?=D?_VTogg3 Q9=Q9_3 Q10=Q10_VTogg3 R10=R10_3 R11=R11_3; ports Sig=S3 ToValve=V3
U_BusDistribution/VTogg4: designators D?=D?_VTogg4 Q9=Q9_4 Q10=Q10_VTogg4 R10=R10_4 R11=R11_4; ports Sig=S4 ToValve=V4
U_BusDistribution/VTogg5: designators D?=D?_VTogg5 Q9=Q9_5 Q10=Q10_VTogg5 R10=R10_5 R11=R11_5; ports Sig=S5 ToValve=V5
U_BusDistribution/VTogg6: designators D?=D?_VTogg6 Q9=Q9_6 Q10=Q10_VTogg6 R10=R10_6 R11=R11_6; ports Sig=S6 ToValve=V6
U_BusDistribution/VTogg7: designators D?=D?_VTogg7 Q9=Q9_7 Q10=Q10_VTogg7 R10=R10_7 R11=R11_7; ports Sig=S7 ToValve=V7
U_BusDistribution/VTogg8: designators D?=D?_VTogg8 Q9=Q9_8 Q10=Q10_VTogg8 R10=R10_8 R11=R11_8; ports Sig=S8 ToValve=V8

### Notes on the sheet
- Valve Toggling

### Library data of the parts
D? = D Zener: as D? on sheet Pre-regulation; Package: 0402; MFG PN: BZT52C9V1LP-7
Q9 = PMOS-2: MOSFET P-CHANNEL 60V 3.1A SOT23; Note: Pin 4 not drawn and electrically connected to Pin 2.; Published: 8-Jun-2000; LatestRevisionDate: 17-Jul-2002; LatestRevisionNote: Re-released for DXP Platform.; DatasheetVersion: PD-9.390D; PackageVersion: Feb-1997; PackageReference: TO-220AB; Publisher: Altium Limited; PackageDescription: TO, Thru-Hole, Vertical, Heatsink Mounted; 3 In-Line Leads; Pitch 2.54 mm; ComponentLink1Description: Manufacturer Link; ComponentLink1URL: http://www.irf.com/
Q10 = MOSFET-N: as Q13 on sheet Switching_Scheme; MDF PN: 2N7002NXAK
R10 R11 = Res1: Resistor; Published: 8-Jun-2000; LatestRevisionDate: 17-Jul-2002; LatestRevisionNote: Re-released for DXP Platform.; PackageReference: AXIAL-0.3; Publisher: Altium Limited; PackageDescription: Axial Device, Thru-Hole; 2 Leads; 0.3 in Pin Spacing

## Nets that join several sheets
5VOUT: BattVoltageLevelDetector (P2.2 R24.2), Regulation (C6.1 L1.1 R15.2), BusDistribution (P1.13 P1.14)
+3.3: ATTINY214-SSNR (T1.3 U1.1), U_Regulation/U_CurrentSensor (IC1_3.5), U_Regulation/U_CurrentSensor (IC1_2.5), U_Regulation/U_CurrentSensor (IC1_1.5)
GND: ATTINY214-SSNR (J5.2 R13.1 T1.2 U1.14), Pre-regulation (Base_Power1.1 Battery_Power1.1 Q2.3), BattVoltageLevelDetector (7 pins), Switching_Scheme (C3.2 Q13.3 R23.1 R36.2), Regulation (6 pins), U_Regulation/U_CurrentSensor (IC1_3.2), U_Regulation/U_CurrentSensor (IC1_2.2), U_Regulation/U_CurrentSensor (IC1_1.2), SwitchingRegulator (19 pins), BusDistribution (21 pins), U_BusDistribution/VTogg1 (D?_VTogg1.1 Q10_VTogg1.3), U_BusDistribution/VTogg2 (D?_VTogg2.1 Q10_VTogg2.3), U_BusDistribution/VTogg3 (D?_VTogg3.1 Q10_VTogg3.3), U_BusDistribution/VTogg4 (D?_VTogg4.1 Q10_VTogg4.3), U_BusDistribution/VTogg5 (D?_VTogg5.1 Q10_VTogg5.3), U_BusDistribution/VTogg6 (D?_VTogg6.1 Q10_VTogg6.3), U_BusDistribution/VTogg7 (D?_VTogg7.1 Q10_VTogg7.3), U_BusDistribution/VTogg8 (D?_VTogg8.1 Q10_VTogg8.3)
IN+: ATTINY214-SSNR (T1.1), U_Regulation/U_CurrentSensor (IC1_3.3 R9_3.2), U_Regulation/U_CurrentSensor (IC1_2.3 R9_2.2), U_Regulation/U_CurrentSensor (IC1_1.3 R9_1.2), SwitchingRegulator (CFF1.2 RB1.2 RF1.2 RS1.2), U_BusDistribution/VTogg1 (Q9_1.3 R10_1.2), U_BusDistribution/VTogg2 (Q9_2.3 R10_2.2), U_BusDistribution/VTogg3 (Q9_3.3 R10_3.2), U_BusDistribution/VTogg4 (Q9_4.3 R10_4.2), U_BusDistribution/VTogg5 (Q9_5.3 R10_5.2), U_BusDistribution/VTogg6 (Q9_6.3 R10_6.2), U_BusDistribution/VTogg7 (Q9_7.3 R10_7.2), U_BusDistribution/VTogg8 (Q9_8.3 R10_8.2)
VAT: ATTINY214-SSNR (R13.2 U1.7), BusDistribution (R5.2 R8.2)
VBAS: Pre-regulation (F2.2), Switching_Scheme (D4.1 R22.2)
VBAT: Pre-regulation (F1.2), BattVoltageLevelDetector (R28.2), Switching_Scheme (5 pins)
18VOUT: Regulation (C5.2 IC3.3), BusDistribution (Q3.3 Q6.3 R3.2 R6.2)
24VOUT: U_Regulation/U_CurrentSensor (IC1_3.4 R9_3.1), BusDistribution (J1.1)
FET_A: Pre-regulation (Q1.2), SwitchingRegulator (13 pins)
IN-: Regulation (C1.1 IC2.4), U_Regulation/U_CurrentSensor (IC1_2.4 R9_2.1)
IN-: Regulation (C4.2 IC3.1), U_Regulation/U_CurrentSensor (IC1_1.4 R9_1.1)
NetC3_1: Pre-regulation (D?.2 Q1.3 R1.2), Switching_Scheme (C3.1 D4.2 Q11.2)
NetIC1_1_1: ATTINY214-SSNR (U1.4), U_Regulation/U_CurrentSensor (IC1_1.1)
NetIC1_2_1: ATTINY214-SSNR (U1.3), U_Regulation/U_CurrentSensor (IC1_2.1)
NetIC1_3_1: ATTINY214-SSNR (U1.2), U_Regulation/U_CurrentSensor (IC1_3.1)
NetP1_19: ATTINY214-SSNR (U1.9), BusDistribution (P1.19)
NetP1_20: ATTINY214-SSNR (U1.8), BusDistribution (P1.20)
S1: BusDistribution (P1.2), U_BusDistribution/VTogg1 (Q10_VTogg1.2)
S2: BusDistribution (P1.3), U_BusDistribution/VTogg2 (Q10_VTogg2.2)
S3: BusDistribution (P1.4), U_BusDistribution/VTogg3 (Q10_VTogg3.2)
S4: BusDistribution (P1.5), U_BusDistribution/VTogg4 (Q10_VTogg4.2)
S5: BusDistribution (P1.6), U_BusDistribution/VTogg5 (Q10_VTogg5.2)
S6: BusDistribution (P1.7), U_BusDistribution/VTogg6 (Q10_VTogg6.2)
S7: BusDistribution (P1.8), U_BusDistribution/VTogg7 (Q10_VTogg7.2)
S8: BusDistribution (P1.9), U_BusDistribution/VTogg8 (Q10_VTogg8.2)
V1: BusDistribution (J2.11), U_BusDistribution/VTogg1 (D?_VTogg1.2 Q9_1.2)
V2: BusDistribution (J2.12), U_BusDistribution/VTogg2 (D?_VTogg2.2 Q9_2.2)
V3: BusDistribution (J2.13), U_BusDistribution/VTogg3 (D?_VTogg3.2 Q9_3.2)
V4: BusDistribution (J2.14), U_BusDistribution/VTogg4 (D?_VTogg4.2 Q9_4.2)
V5: BusDistribution (J2.15), U_BusDistribution/VTogg5 (D?_VTogg5.2 Q9_5.2)
V6: BusDistribution (J2.16), U_BusDistribution/VTogg6 (D?_VTogg6.2 Q9_6.2)
V7: BusDistribution (J2.17), U_BusDistribution/VTogg7 (D?_VTogg7.2 Q9_7.2)
V8: BusDistribution (J2.18), U_BusDistribution/VTogg8 (D?_VTogg8.2 Q9_8.2)